# Altium project Gate_Driver_Boost_Conv_V1.0.PrjPcb
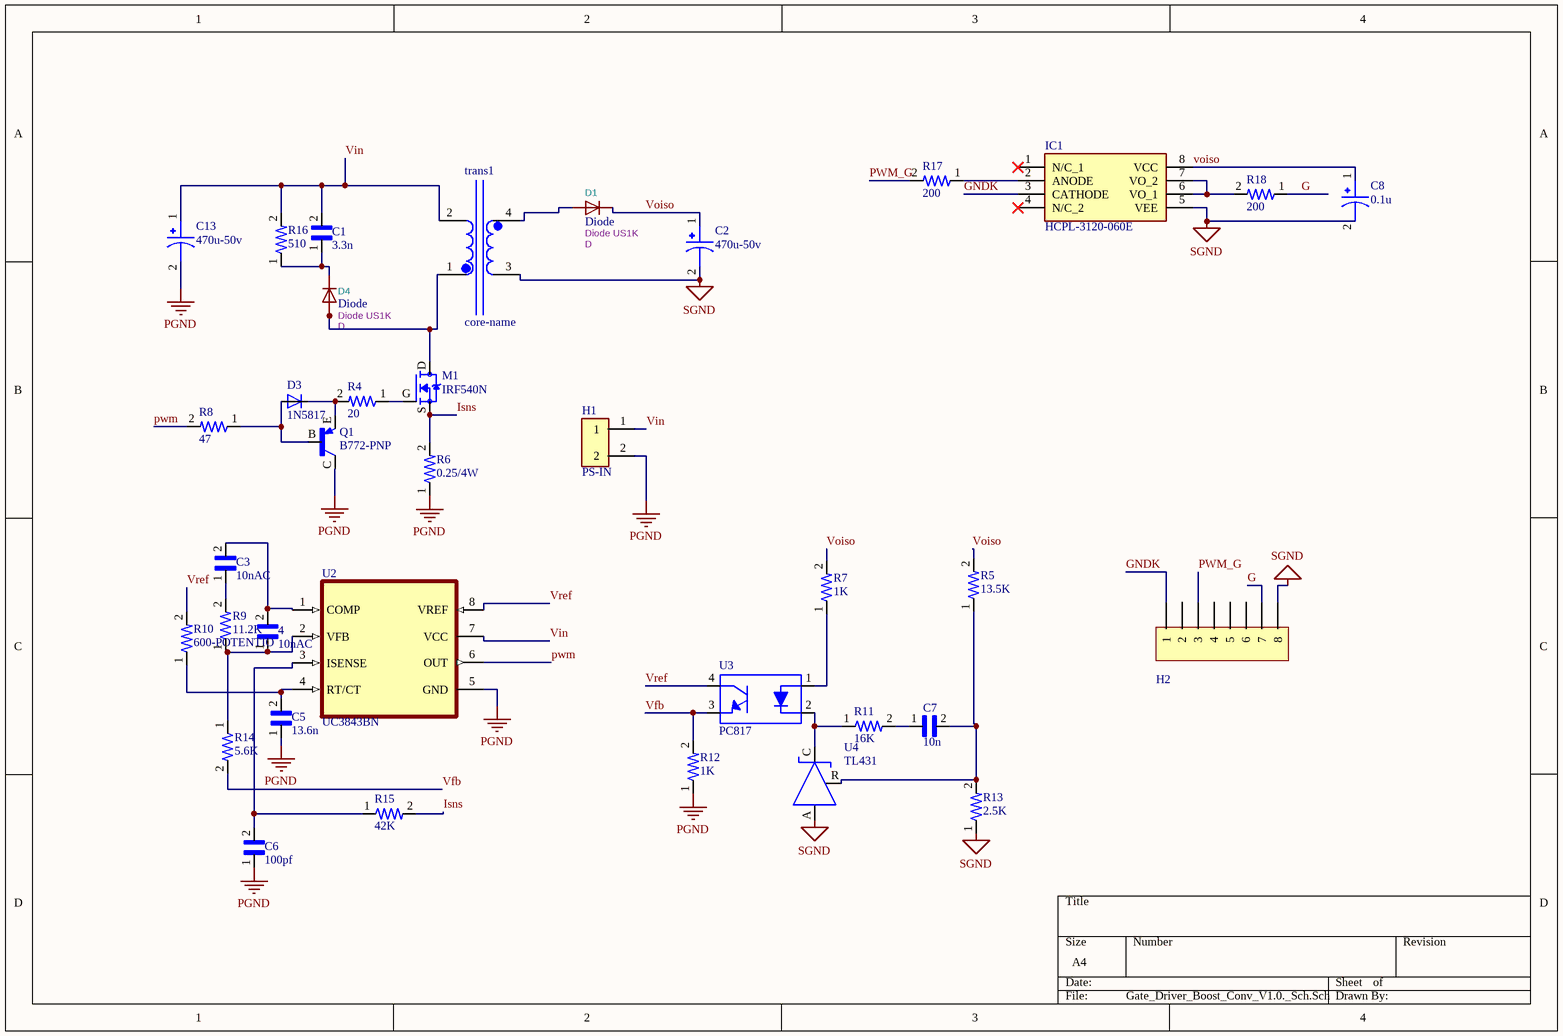
[diagram p0: Gate_Driver_Boost_Conv_V1.0._Sch.SchDoc]
1 sheet, 36 parts. Net scope: global (net labels, ports and power ports of the same name join across sheets).
Board file: Gate_Driver_Boost_Conv_V1.0_PCB.PcbDoc

## Sheet Gate_Driver_Boost_Conv_V1.0._Sch.SchDoc
size A4; SheetNumber: 1; SheetTotal: 1

### Parts
4  10nAC  [CAP_1206]
C1  3.3n  [CAP_1206]
C2  470u-50v  [WCAP-ASLI_D5H5.5]
C3  10nAC  [CAP_1206]
C5  13.6n  [CAP_1206]
C6  100pf  [CAP_1206]
C7  10n  [CAP_1206]
C8  0.1u  [CAP_1206]
C13  470u-50v  [WCAP-ASLI_D5H5.5]
D1  Diode  value Diode US1K  Reference: D  [us1k_smd]
D3  1N5817  [1N5817W]
D4  Diode  value Diode US1K  Reference: D  [us1k_smd]
H1  PS-IN  [plug]
H2  H2*8  [HDR2X8]  (value not drawn)
IC1  HCPL-3120-060E  [DIP762W65P254L965H470Q8N]
M1  IRF540N  [IRF540N_smd]
Q1  B772-PNP  [b772_smd]
R4  20  [RES_1206]
R5  13.5K  [RES_1206]
R6  0.25/4W  [RES_1206]
R7  1K  [RES_1206]
R8  47  [RES_1206]
R9  11.2K  [RES_1206]
R10  600-POTENTIO  [RES_1206]
R11  16K  [RES_1206]
R12  1K  [RES_1206]
R13  2.5K  [RES_1206]
R14  5.6K  [RES_1206]
R15  42K  [RES_1206]
R16  510  [RES_1206]
R17  200  [RES_1206]
R18  200  [RES_1206]
trans1  core-name  [Transformer_2]
U2  UC3843BN  [uc3843_smd]
U3  PC817  [pc816_smd]
U4  TL431  [VREG_TL431IPK]

### Nets
PGND: C5.1 C6.1 C13.2 H1.2 Q1.C R6.1 R12.1 U2.5(GND)
SGND: C2.2 C8.2 H2.8 IC1.5(VEE) R13.1 trans1.3 U4.A
G: H2.7 R18.1
GNDK: H2.1 IC1.3(CATHODE)
Isns: M1.S R6.2 R15.2
pwm: R8.2 U2.6(OUT)
PWM_G: H2.3 R17.2
Vfb: R12.2 R14.2 U3.3
Vin: C1.2 C13.1 H1.1 R16.2 trans1.2 U2.7(VCC)
Voiso: C2.1 C8.1 D1.K IC1.8(VCC) R5.2 R7.2
Vref: R10.2 U2.8(VREF) U3.4
Net4_1: 4.1 R9.1 R14.1 U2.2(VFB)
Net4_2: 4.2 C3.2 U2.1(COMP)
NetC1_1: C1.1 D4.K R16.1
NetC3_1: C3.1 R9.2
NetC5_2: C5.2 R10.1 U2.4(RT/CT)
NetC6_2: C6.2 R15.1 U2.3(ISENSE)
NetC7_1: C7.1 R11.2
NetC7_2: C7.2 R5.1 R13.2 U4.R
NetD1_A: D1.A trans1.4
NetD3_A: D3.A Q1.B R8.1
NetD3_C: D3.C Q1.E R4.2
NetD4_A: D4.A M1.D trans1.1
NetIC1_2: IC1.2(ANODE) R17.1
NetIC1_6: IC1.6(VO_1) IC1.7(VO_2) R18.2
NetM1_G: M1.G R4.1
NetR7_1: R7.1 U3.1
NetR11_1: R11.1 U3.2 U4.C

Not connected (* = marked no-connect by the designer): H2 2 4 5 6; IC1 1(N/C_1)* 4(N/C_2)*

### Library data of the parts
4 C1 C3 C5-C7 = CAP-AC
C2 C8 C13 = CAP-DC
D3 = 1N5817: Lite-On 1N5817, Schottky Diode, 20V 3A, 2-Pin DO-201AD; Manufacturer: Vishay; Manufacturer Part Number: 1N5820; Forward Voltage: 850mV; Element Configuration: Single; Peak Non-Repetitive Surge Current: 80A; Max Reverse Current: 150uA; Max Reverse Leakage Current: 2mA; Supplier 1: RSComponents; Supplier Part Number 1: 700-9899; Stock 1: 0; Mount: Through Hole; Case/Package: DO-201AD; Number of Pins: 2; Min Operating Temperature: -65°C; Max Operating Temperature: 125°C; Forward Current: 3A; Packaging: Bulk; Max Repetitive Reverse Voltage (Vrrm): 20V; Max Surge Current: 80A; Max Forward Surge Current (Ifsm): 80A; Average Rectified Current: 3A; Length: 9.5mm; Width: 5.3mm; Height: 5.3mm; Radiation Hardening: No; RoHS Compliant: No; ComponentLink1URL: http://www.liteon-semi.com/download.php?hSFile=1N5820-1N5822-5.pdf&hDFile=tecfile01312524214.pdf&src-supplier=Avnet+Asia; ComponentLink1Description: http://www.liteon-semi.com/download.php?hSFile=1N5820-1N5822-5.pdf&hDFile=tecfile01312524214.pdf&src-supplier=Avnet+Asia; ComponentLink2URL: http://docs-usa.electrocomponents.com/techlib:/itc_doclist_US.htm?stockno=7009899&src-supplier=Allied+Electronics; ComponentLink2Description: http://docs-usa.electrocomponents.com/techlib:/itc_doclist_US.htm?stockno=7009899&src-supplier=Allied+Electronics
H1 = PS-plug
H2 = Header 8X2
IC1 = HCPL-3120-060E: Integrated Circuit; Manufacturer_Name: Avago Technologies; Datasheet Link: https://www.broadcom.com/products/optocouplers/industrial-plastic/isolated-gate-drive-optocouplers/gate-drives/hcpl-3120; Height: 4.7mm; Manufacturer_Part_Number: HCPL-3120-060E; Mouser Part Number: 630-HCPL-3120-060E; Mouser Price/Stock: https://www.mouser.co.uk/ProductDetail/Broadcom-Avago/HCPL-3120-060E?qs=s%252BgfxR24RQ6Hbv8y%252BiVbRA%3D%3D
M1 = IRF540N: Mosfet, Power; N-ch; Vdss 100V; Rds(on) 44MILLIOHMS; Id 33A; TO-220AB; Pd 130W; -55DEG; Manufacturer: International Rectifier; Gate to Source Voltage (Vgs): 20V; Number of Elements: 1; Supplier 1: Future Electronics; Supplier Part Number 1: IRF540NPBF-TUBE; Manufacturer Part Number: IRF540N; Stock 1: 0; Mount: Through Hole; Case/Package: TO-220AB; Number of Pins: 3; Min Operating Temperature: -55°C; Max Operating Temperature: 175°C; Continuous Drain Current (ID): 33A; Power Dissipation: 130W; RoHS Compliant: No; ComponentLink1URL: http://www.produktinfo.conrad.com/datenblaetter/150000-174999/162412-da-01-en-IRF_540_N.pdf?src-supplier=Conrad; ComponentLink1Description: http://www.produktinfo.conrad.com/datenblaetter/150000-174999/162412-da-01-en-IRF_540_N.pdf?src-supplier=Conrad
R4-R18 = RES
trans1 = flyback trans
U2 = UC3843BN: IC REG CTRLR BST/FLYBK 8-MINIDIP; Manufacturer: STMicroelectronics; Max Supply Voltage: 30V; Output Current: 1A; Rise Time: 50ns; Number of Outputs: 1; Switching Frequency: 500kHz; Output Voltage: 5.1V; Duty Cycle: 100%; Topology: Boost,Flyback; Frequency: 250kHz; Min Supply Voltage: 12V; Max Supply Current: 17mA; Power Dissipation: 800mW; Supplier 1: Arrow Electronics; Supplier Part Number 1: UC3843BN; Manufacturer Part Number: UC3843BN; Stock 1: 669; Pricing 1: 1=0.9063, 10=0.7523, 25=0.7389, 100=0.6172, 250=0.5737, 500=0.4903, 1000=0.3493, 4000=0.3129, 5000=0.3123, 6000=0.3104, 8000=0.3085, 10000=0.3066, 20000=0.3047, 25000=0.3027, 30000=0.3008, 50000=0.2988 (USD); Mount: Through Hole; Case/Package: PDIP; Number of Pins: 8; Weight: 0.032805oz; Min Operating Temperature: -40°C; Max Operating Temperature: 150°C; Package Quantity: 50; Packaging: Rail/Tube; Max Frequency: 500kHz; Max Duty Cycle: 100%; Fall Time: 50ns; Series: -; Max Power Dissipation: 800mW; Length: 10.92mm; Width: 6.6mm; Height: 3.32mm; Radiation Hardening: No; Lead Free: Lead Free; RoHS Compliant: Yes; REACH SVHC: No SVHC; ComponentLink1URL: http://www.st.com/content/ccc/resource/technical/document/datasheet/b6/e8/cc/ba/4f/cd/42/9b/CD00000966.pdf/files/CD00000966.pdf/jcr:content/translations/en.CD00000966.pdf?src-supplier=Digi-Key; ComponentLink1Description: http://www.st.com/content/ccc/resource/technical/document/datasheet/b6/e8/cc/ba/4f/cd/42/9b/CD00000966.pdf/files/CD00000966.pdf/jcr:content/translations/en.CD00000966.pdf?src-supplier=Digi-Key; ComponentLink2URL: http://www.mouser.com/ds/2/389/uc2842b-974450.pdf?src-supplier=Mouser; ComponentLink2Description: http://www.mouser.com/ds/2/389/uc2842b-974450.pdf?src-supplier=Mouser; ComponentLink3URL: http://www.st.com/web/en/resource/technical/document/datasheet/CD00000966.pdf?src-supplier=Avnet; ComponentLink3Description: http://www.st.com/web/en/resource/technical/document/datasheet/CD00000966.pdf?src-supplier=Avnet; ComponentLink4URL: http://www.st.com/web/en/resource/technical/document/datasheet/CD00000966.pdf?src-supplier=Future+Electronics; ComponentLink4Description: http://www.st.com/web/en/resource/technical/document/datasheet/CD00000966.pdf?src-supplier=Future+Electronics; ComponentLink5URL: https://www.verical.com/server-webapp/html/getDatasheet?partID=66041&src-supplier=Verical; ComponentLink5Description: https://www.verical.com/server-webapp/html/getDatasheet?partID=66041&src-supplier=Verical; ComponentLink6URL: http://www.produktinfo.conrad.com/datenblaetter/1100000-1199999/001185662-da-01-en-IC_REG_CTRLR_PWM_CM_UC3843BN_DIP_8_STM.pdf?src-supplier=Conrad; ComponentLink6Description: http://www.produktinfo.conrad.com/datenblaetter/1100000-1199999/001185662-da-01-en-IC_REG_CTRLR_PWM_CM_UC3843BN_DIP_8_STM.pdf?src-supplier=Conrad
U3 = PC817: Optocoupler DC-IN 1-CH Transistor DC-OUT 4-Pin PDIP Sleeve; Manufacturer: Sharp; Reverse Breakdown Voltage: 6V; Forward Voltage: 1.4V; Forward Current: 50mA; Rise Time: 18000ns; Number of Elements: 1; Power Dissipation: 200mW; Collector Emitter Saturation Voltage: 200mV; Collector Emitter Voltage (VCEO): 35V; Input Type: DC; Current Transfer Ratio: 600%; Supplier 1: Arrow Electronics; Supplier Part Number 1: PC817; Manufacturer Part Number: PC817; Stock 1: 0; Mount: Through Hole; Case/Package: PDIP; Number of Pins: 4; Min Operating Temperature: -30°C; Max Operating Temperature: 100°C; Fall Time: 18000ns; Packaging: Sleeve; RoHS Compliant: No
U4 = TL431CZ: V-Ref Adjustable 2.495V to 36V 100mA 3-Pin TO-92 Bulk; Manufacturer: STMicroelectronics; Max Input Voltage: 37V; Tolerance: 2.21%; Cathode Current: 1mA; Temperature Coefficient: 100ppm/°C; Reference Type: Shunt,Adjustable; Number of Channels: 1; Accuracy: 2%; Supplier 1: Arrow Electronics; Supplier Part Number 1: TL431CZ; Manufacturer Part Number: TL431CZ; Stock 1: 5333; Pricing 1: 1=0.4405, 10=0.3422, 100=0.2291, 500=0.1883, 1000=0.1722, 2500=0.1137, 10000=0.083, 1=0.3921, 10=0.3046, 100=0.2039, 500=0.1676, 1000=0.1299, 2500=0.1012, 10000=0.0723 (USD); Mount: Through Hole; Case/Package: TO-92; Number of Pins: 3; Weight: 0.01lb; Min Operating Temperature: 0°C; Max Operating Temperature: 70°C; Output Voltage: 36V; Max Output Current: 100mA; Packaging: Bulk; Package Quantity: 1; Output Current: 100mA; Max Output Voltage: 36V; Reference Voltage: 36V; Min Output Voltage: 2.495V; Output Type: Adjustable; Series: -; Nominal Supply Current: 1mA; Supply Current: 1mA; Length: 4.7mm; Width: 3.7mm; Height: 4.4mm; Radiation Hardening: No; REACH SVHC: No SVHC; Lead Free: Lead Free; RoHS Compliant: Yes; ComponentLink1URL: http://www.st.com/web/en/resource/technical/document/datasheet/CD00000986.pdf?src-supplier=Digi-Key; ComponentLink1Description: http://www.st.com/web/en/resource/technical/document/datasheet/CD00000986.pdf?src-supplier=Digi-Key; ComponentLink2URL: http://www.st.com/content/ccc/resource/technical/document/datasheet/2d/27/af/41/03/e2/44/8e/CD00000986.pdf/files/CD00000986.pdf/jcr:content/translations/en.CD00000986.pdf?src-supplier=Digi-Key; ComponentLink2Description: http://www.st.com/content/ccc/resource/technical/document/datasheet/2d/27/af/41/03/e2/44/8e/CD00000986.pdf/files/CD00000986.pdf/jcr:content/translations/en.CD00000986.pdf?src-supplier=Digi-Key; ComponentLink3URL: http://www.farnell.com/datasheets/1690313.pdf?src-supplier=Element14; ComponentLink3Description: http://www.farnell.com/datasheets/1690313.pdf?src-supplier=Element14; ComponentLink4URL: http://www.rapidonline.com/pdf/82-0290.pdf?src-supplier=Rapid+Electronics; ComponentLink4Description: http://www.rapidonline.com/pdf/82-0290.pdf?src-supplier=Rapid+Electronics; ComponentLink5URL: https://www.verical.com/server-webapp/html/getDatasheet?partID=98639&src-supplier=Verical; ComponentLink5Description: https://www.verical.com/server-webapp/html/getDatasheet?partID=98639&src-supplier=Verical; ComponentLink6URL: http://www.produktinfo.conrad.com/datenblaetter/150000-174999/155641-da-01-en-SPG_REF_TL431CZ_STM.pdf?src-supplier=Conrad; ComponentLink6Description: http://www.produktinfo.conrad.com/datenblaetter/150000-174999/155641-da-01-en-SPG_REF_TL431CZ_STM.pdf?src-supplier=Conrad
D1 D4 = Diode: Datasheet: https://diotec.com/de/produktliste/D.html; ki_keywords: Diode; ki_description: Diode